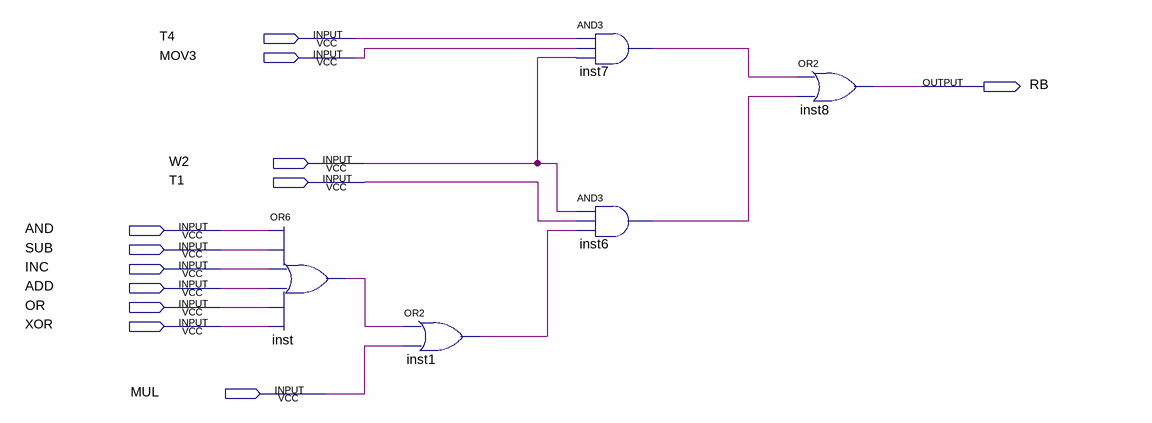
[diagram p0: schematic sheet]
// Quartus schematic RB.bdf as structural Verilog: 5 symbols, 12 pins
module RB (
  input  T4,
  input  MOV3,
  input  W2,
  input  T1,
  input  AND,
  input  SUB,
  input  INC,
  input  ADD,
  input  OR,
  input  XOR,
  input  MUL,
  output RB
);

  wire inst1_out, inst6_out, inst7_out, inst_out;

  or inst (inst_out, AND, SUB, INC, ADD, OR, XOR);
  or inst1 (inst1_out, inst_out, MUL);
  and inst7 (inst7_out, T4, MOV3, W2);
  and inst6 (inst6_out, W2, T1, inst1_out);
  or inst8 (RB, inst7_out, inst6_out);
endmodule
